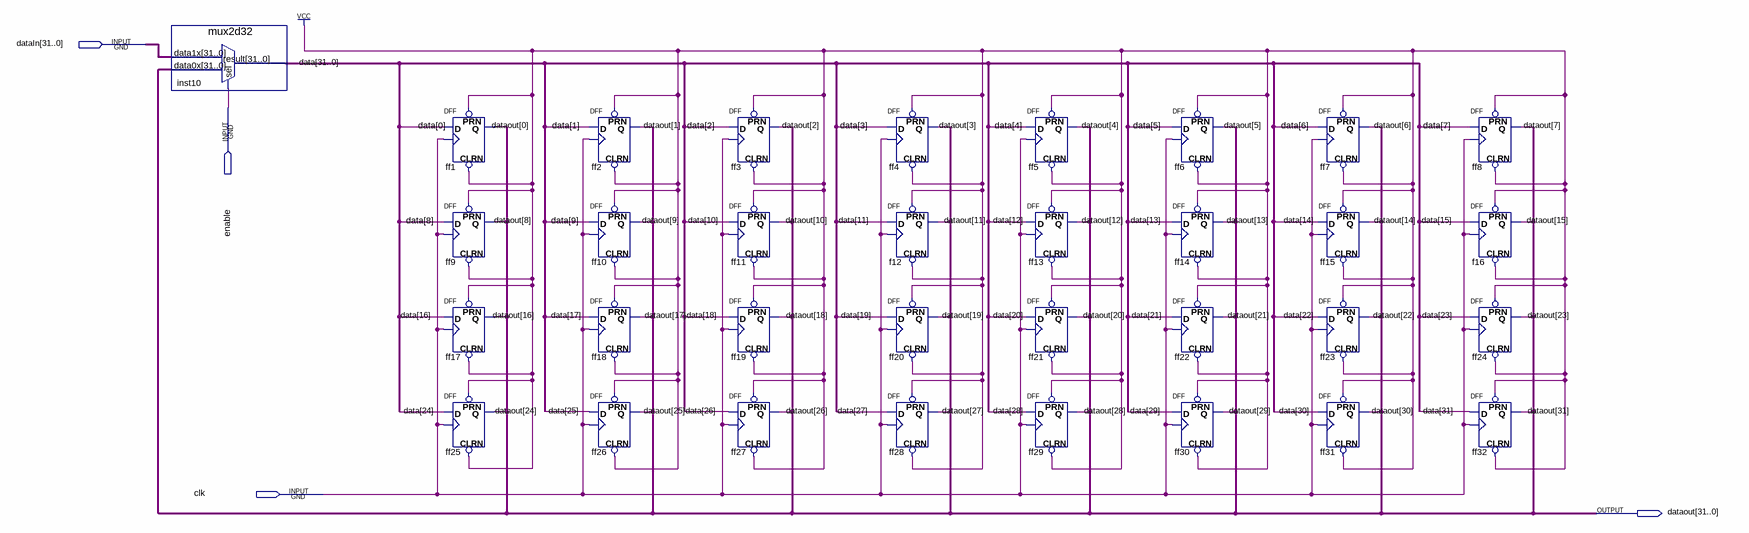
[diagram p0: schematic sheet]
// Quartus schematic register32.bdf as structural Verilog: 33 symbols, 4 pins
module register32 (
  input  [31:0] dataIn,
  input  enable,
  input  clk,
  output [31:0] dataout
);

  wire [31:0] data;

  mux2d32 inst10 (.data1x(dataIn), .data0x(dataout), .sel(enable), .result(data));
  DFF ff1 (.CLRN(1'b1), .CLK(clk), .D(data[0]), .PRN(1'b1), .Q(dataout[0]));
  DFF ff9 (.CLRN(1'b1), .CLK(clk), .D(data[8]), .PRN(1'b1), .Q(dataout[8]));
  DFF ff17 (.CLRN(1'b1), .CLK(clk), .D(data[16]), .PRN(1'b1), .Q(dataout[16]));
  DFF ff25 (.CLRN(1'b1), .CLK(clk), .D(data[24]), .PRN(1'b1), .Q(dataout[24]));
  DFF ff2 (.CLRN(1'b1), .CLK(clk), .D(data[1]), .PRN(1'b1), .Q(dataout[1]));
  DFF ff10 (.CLRN(1'b1), .CLK(clk), .D(data[9]), .PRN(1'b1), .Q(dataout[9]));
  DFF ff18 (.CLRN(1'b1), .CLK(clk), .D(data[17]), .PRN(1'b1), .Q(dataout[17]));
  DFF ff26 (.CLRN(1'b1), .CLK(clk), .D(data[25]), .PRN(1'b1), .Q(dataout[25]));
  DFF ff3 (.CLRN(1'b1), .CLK(clk), .D(data[2]), .PRN(1'b1), .Q(dataout[2]));
  DFF ff11 (.CLRN(1'b1), .CLK(clk), .D(data[10]), .PRN(1'b1), .Q(dataout[10]));
  DFF ff19 (.CLRN(1'b1), .CLK(clk), .D(data[18]), .PRN(1'b1), .Q(dataout[18]));
  DFF ff27 (.CLRN(1'b1), .CLK(clk), .D(data[26]), .PRN(1'b1), .Q(dataout[26]));
  DFF ff4 (.CLRN(1'b1), .CLK(clk), .D(data[3]), .PRN(1'b1), .Q(dataout[3]));
  DFF f12 (.CLRN(1'b1), .CLK(clk), .D(data[11]), .PRN(1'b1), .Q(dataout[11]));
  DFF ff20 (.CLRN(1'b1), .CLK(clk), .D(data[19]), .PRN(1'b1), .Q(dataout[19]));
  DFF ff28 (.CLRN(1'b1), .CLK(clk), .D(data[27]), .PRN(1'b1), .Q(dataout[27]));
  DFF ff5 (.CLRN(1'b1), .CLK(clk), .D(data[4]), .PRN(1'b1), .Q(dataout[4]));
  DFF ff13 (.CLRN(1'b1), .CLK(clk), .D(data[12]), .PRN(1'b1), .Q(dataout[12]));
  DFF ff21 (.CLRN(1'b1), .CLK(clk), .D(data[20]), .PRN(1'b1), .Q(dataout[20]));
  DFF ff29 (.CLRN(1'b1), .CLK(clk), .D(data[28]), .PRN(1'b1), .Q(dataout[28]));
  DFF ff6 (.CLRN(1'b1), .CLK(clk), .D(data[5]), .PRN(1'b1), .Q(dataout[5]));
  DFF ff14 (.CLRN(1'b1), .CLK(clk), .D(data[13]), .PRN(1'b1), .Q(dataout[13]));
  DFF ff22 (.CLRN(1'b1), .CLK(clk), .D(data[21]), .PRN(1'b1), .Q(dataout[21]));
  DFF ff30 (.CLRN(1'b1), .CLK(clk), .D(data[29]), .PRN(1'b1), .Q(dataout[29]));
  DFF ff7 (.CLRN(1'b1), .CLK(clk), .D(data[6]), .PRN(1'b1), .Q(dataout[6]));
  DFF ff15 (.CLRN(1'b1), .CLK(clk), .D(data[14]), .PRN(1'b1), .Q(dataout[14]));
  DFF ff23 (.CLRN(1'b1), .CLK(clk), .D(data[22]), .PRN(1'b1), .Q(dataout[22]));
  DFF ff31 (.CLRN(1'b1), .CLK(clk), .D(data[30]), .PRN(1'b1), .Q(dataout[30]));
  DFF ff8 (.CLRN(1'b1), .CLK(clk), .D(data[7]), .PRN(1'b1), .Q(dataout[7]));
  DFF f16 (.CLRN(1'b1), .CLK(clk), .D(data[15]), .PRN(1'b1), .Q(dataout[15]));
  DFF ff24 (.CLRN(1'b1), .CLK(clk), .D(data[23]), .PRN(1'b1), .Q(dataout[23]));
  DFF ff32 (.CLRN(1'b1), .CLK(clk), .D(data[31]), .PRN(1'b1), .Q(dataout[31]));
endmodule
